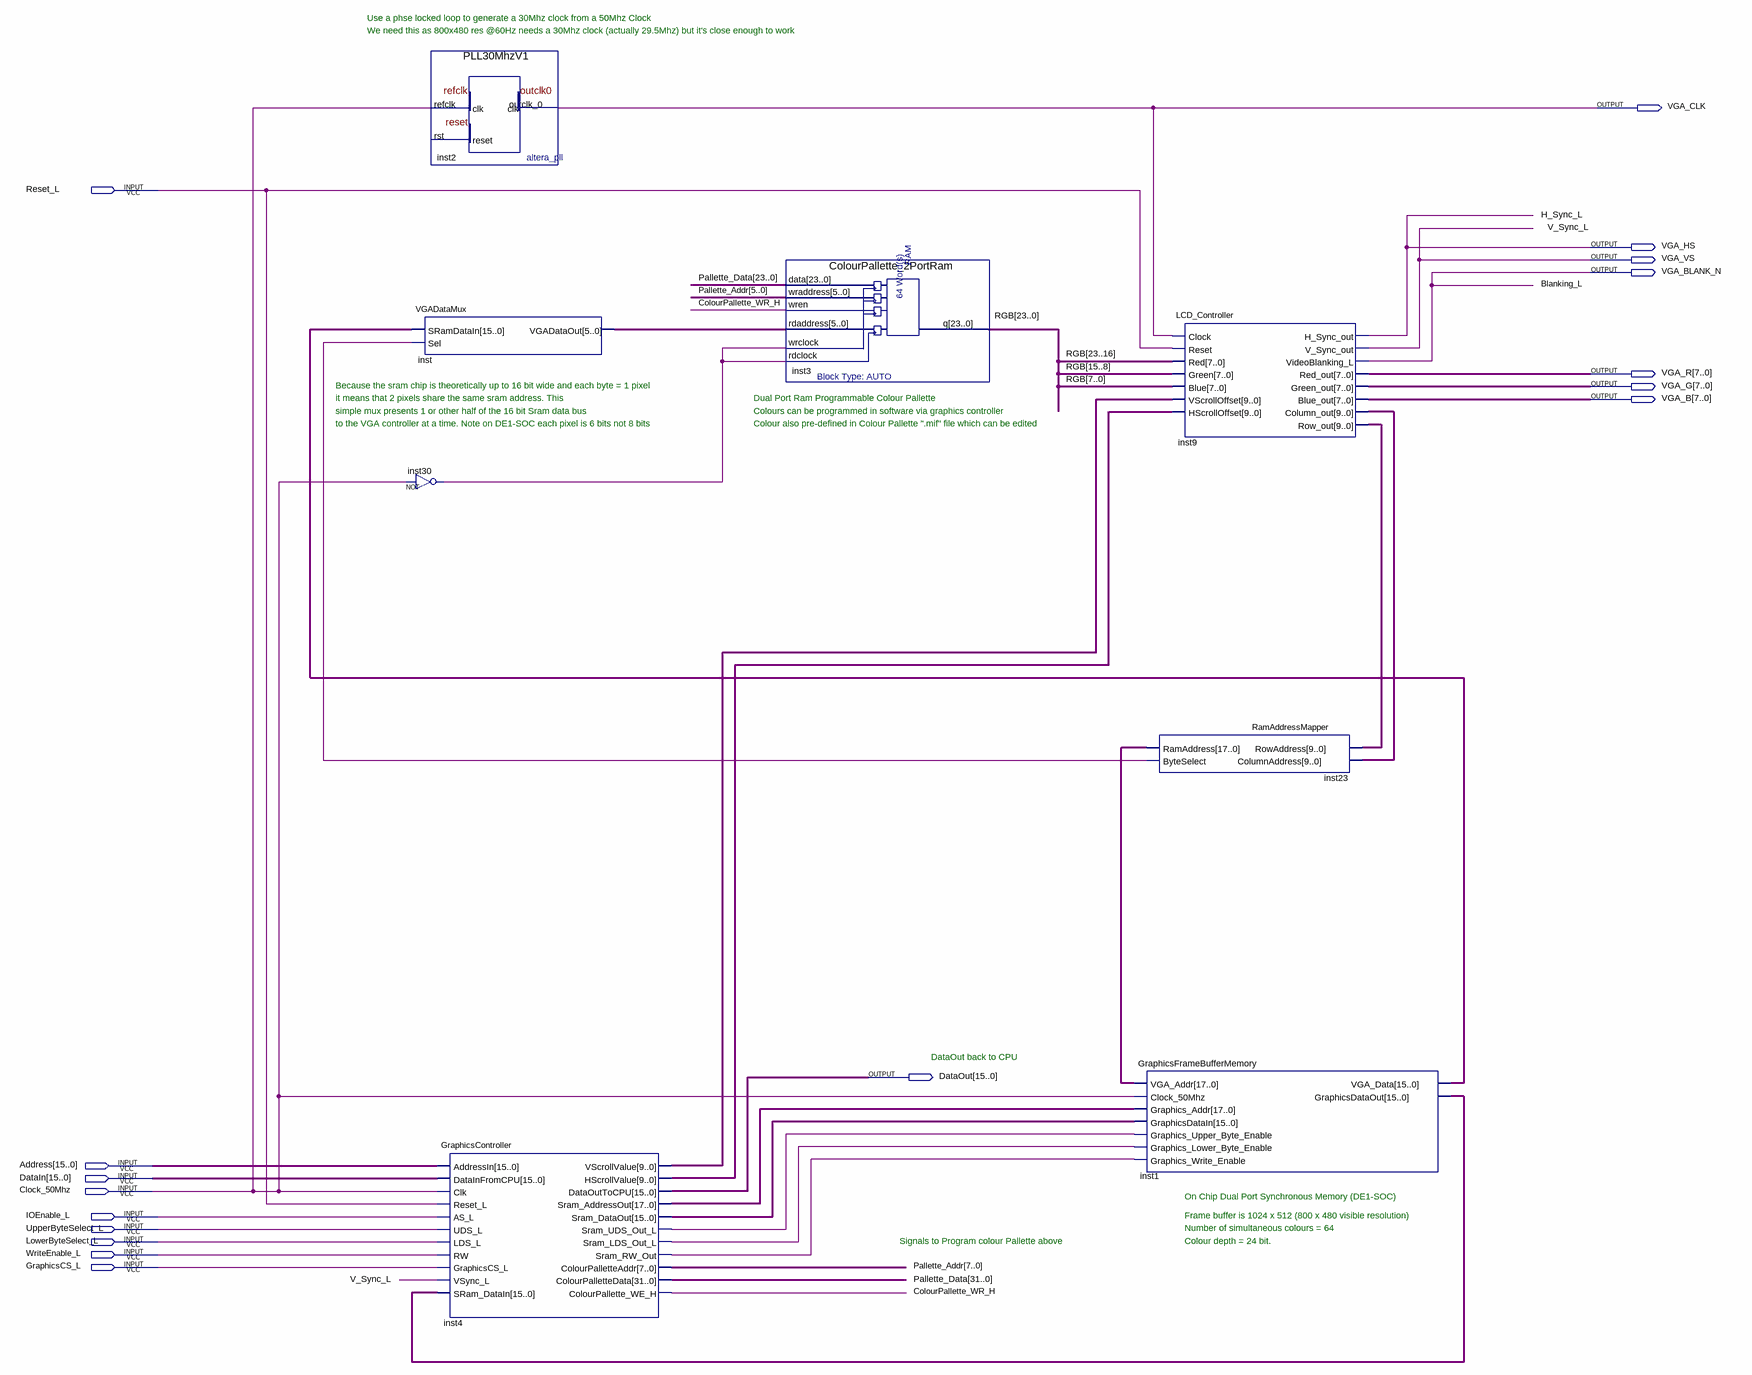
[diagram p0: schematic sheet]
// Quartus schematic Graphics_and_Video_Controller.bdf as structural Verilog: 8 symbols, 17 pins
module Graphics_and_Video_Controller (
  input  Reset_L,
  input  [15:0] Address,
  input  [15:0] DataIn,
  input  Clock_50Mhz,
  input  IOEnable_L,
  input  UpperByteSelect_L,
  input  LowerByteSelect_L,
  input  WriteEnable_L,
  input  GraphicsCS_L,
  output VGA_CLK,
  output VGA_HS,
  output VGA_VS,
  output VGA_BLANK_N,
  output [7:0] VGA_R,
  output [7:0] VGA_G,
  output [7:0] VGA_B,
  output [15:0] DataOut
);

  wire ColourPallette_WR_H, inst4_sram_lds_out_l, inst4_sram_rw_out, inst4_sram_uds_out_l, inst23_byteselect,
       inst30_out;
  wire [5:0] inst_vgadataout;
  wire [7:0] Pallette_Addr;
  wire [9:0] inst4_hscrollvalue, inst4_vscrollvalue, inst9_column_out, inst9_row_out;
  wire [15:0] inst1_graphicsdataout, inst1_vga_data, inst4_sram_dataout;
  wire [17:0] inst4_sram_addressout, inst23_ramaddress;
  wire [23:0] RGB;
  wire [31:0] Pallette_Data;

  VGADataMux inst (.SRamDataIn(inst1_vga_data), .Sel(inst23_byteselect), .VGADataOut(inst_vgadataout));
  not inst30 (inst30_out, Clock_50Mhz);
  PLL30MhzV1 inst2 (.refclk(Clock_50Mhz), .outclk_0(VGA_CLK));  // open: rst
  GraphicsController inst4 (
    .AddressIn(Address), .DataInFromCPU(DataIn), .Clk(Clock_50Mhz), .Reset_L(Reset_L), .AS_L(IOEnable_L),
    .UDS_L(UpperByteSelect_L), .LDS_L(LowerByteSelect_L), .RW(WriteEnable_L), .GraphicsCS_L(GraphicsCS_L),
    .VSync_L(VGA_VS), .SRam_DataIn(inst1_graphicsdataout), .VScrollValue(inst4_vscrollvalue),
    .HScrollValue(inst4_hscrollvalue), .DataOutToCPU(DataOut), .Sram_AddressOut(inst4_sram_addressout),
    .Sram_DataOut(inst4_sram_dataout), .Sram_UDS_Out_L(inst4_sram_uds_out_l),
    .Sram_LDS_Out_L(inst4_sram_lds_out_l), .Sram_RW_Out(inst4_sram_rw_out),
    .ColourPalletteAddr(Pallette_Addr), .ColourPalletteData(Pallette_Data),
    .ColourPallette_WE_H(ColourPallette_WR_H));
  ColourPallette_2PortRam inst3 (
    .data(Pallette_Data[23:0]), .wraddress(Pallette_Addr[5:0]), .wren(ColourPallette_WR_H),
    .rdaddress(inst_vgadataout), .wrclock(inst30_out), .rdclock(inst30_out), .q(RGB));
  LCD_Controller inst9 (
    .Clock(VGA_CLK), .Reset(Reset_L), .Red(RGB[23:16]), .Green(RGB[15:8]), .Blue(RGB[7:0]),
    .VScrollOffset(inst4_vscrollvalue), .HScrollOffset(inst4_hscrollvalue), .H_Sync_out(VGA_HS),
    .V_Sync_out(VGA_VS), .VideoBlanking_L(VGA_BLANK_N), .Red_out(VGA_R), .Green_out(VGA_G), .Blue_out(VGA_B),
    .Column_out(inst9_column_out), .Row_out(inst9_row_out));
  RamAddressMapper inst23 (
    .RowAddress(inst9_row_out), .ColumnAddress(inst9_column_out), .RamAddress(inst23_ramaddress),
    .ByteSelect(inst23_byteselect));
  GraphicsFrameBufferMemory inst1 (
    .VGA_Addr(inst23_ramaddress), .Clock_50Mhz(Clock_50Mhz), .Graphics_Addr(inst4_sram_addressout),
    .GraphicsDataIn(inst4_sram_dataout), .Graphics_Upper_Byte_Enable(inst4_sram_uds_out_l),
    .Graphics_Lower_Byte_Enable(inst4_sram_lds_out_l), .Graphics_Write_Enable(inst4_sram_rw_out),
    .VGA_Data(inst1_vga_data), .GraphicsDataOut(inst1_graphicsdataout));

  // Other names for the same wires on the sheet: Blanking_L = VGA_BLANK_N; H_Sync_L = VGA_HS; V_Sync_L = VGA_VS

  // Notes on the sheet:
  //   Use a phse locked loop to generate a 30Mhz clock from a 50Mhz Clock
  //   We need this as 800x480 res @60Hz needs a 30Mhz clock (actually 29.5Mhz) but it's close enough to work
  //   Because the sram chip is theoretically up to 16 bit wide and each byte = 1 pixel
  //   it means that 2 pixels share the same sram address. This
  //   Dual Port Ram Programmable Colour Pallette
  //   simple mux presents 1 or other half of the 16 bit Sram data bus 
  //   Colours can be programmed in software via graphics controller
  //   to the VGA controller at a time. Note on DE1-SOC each pixel is 6 bits not 8 bits
  //   Colour also pre-defined in Colour Pallette ".mif" file which can be edited
  //   DataOut back to CPU
  //   On Chip Dual Port Synchronous Memory (DE1-SOC)
  //   Frame buffer is 1024 x 512 (800 x 480 visible resolution)
  //   Number of simultaneous colours = 64
  //   Signals to Program colour Pallette above
  //   Colour depth = 24 bit.
endmodule
